# Altium schematic sheet thermocouple_1.SchDoc
size B; Address1: MILWAUKEE TOOL; Address2: 13135 W. Lisbon Rd.; Address3: Brookfield, WI 53005; SheetNumber: 1; SheetTotal: 1
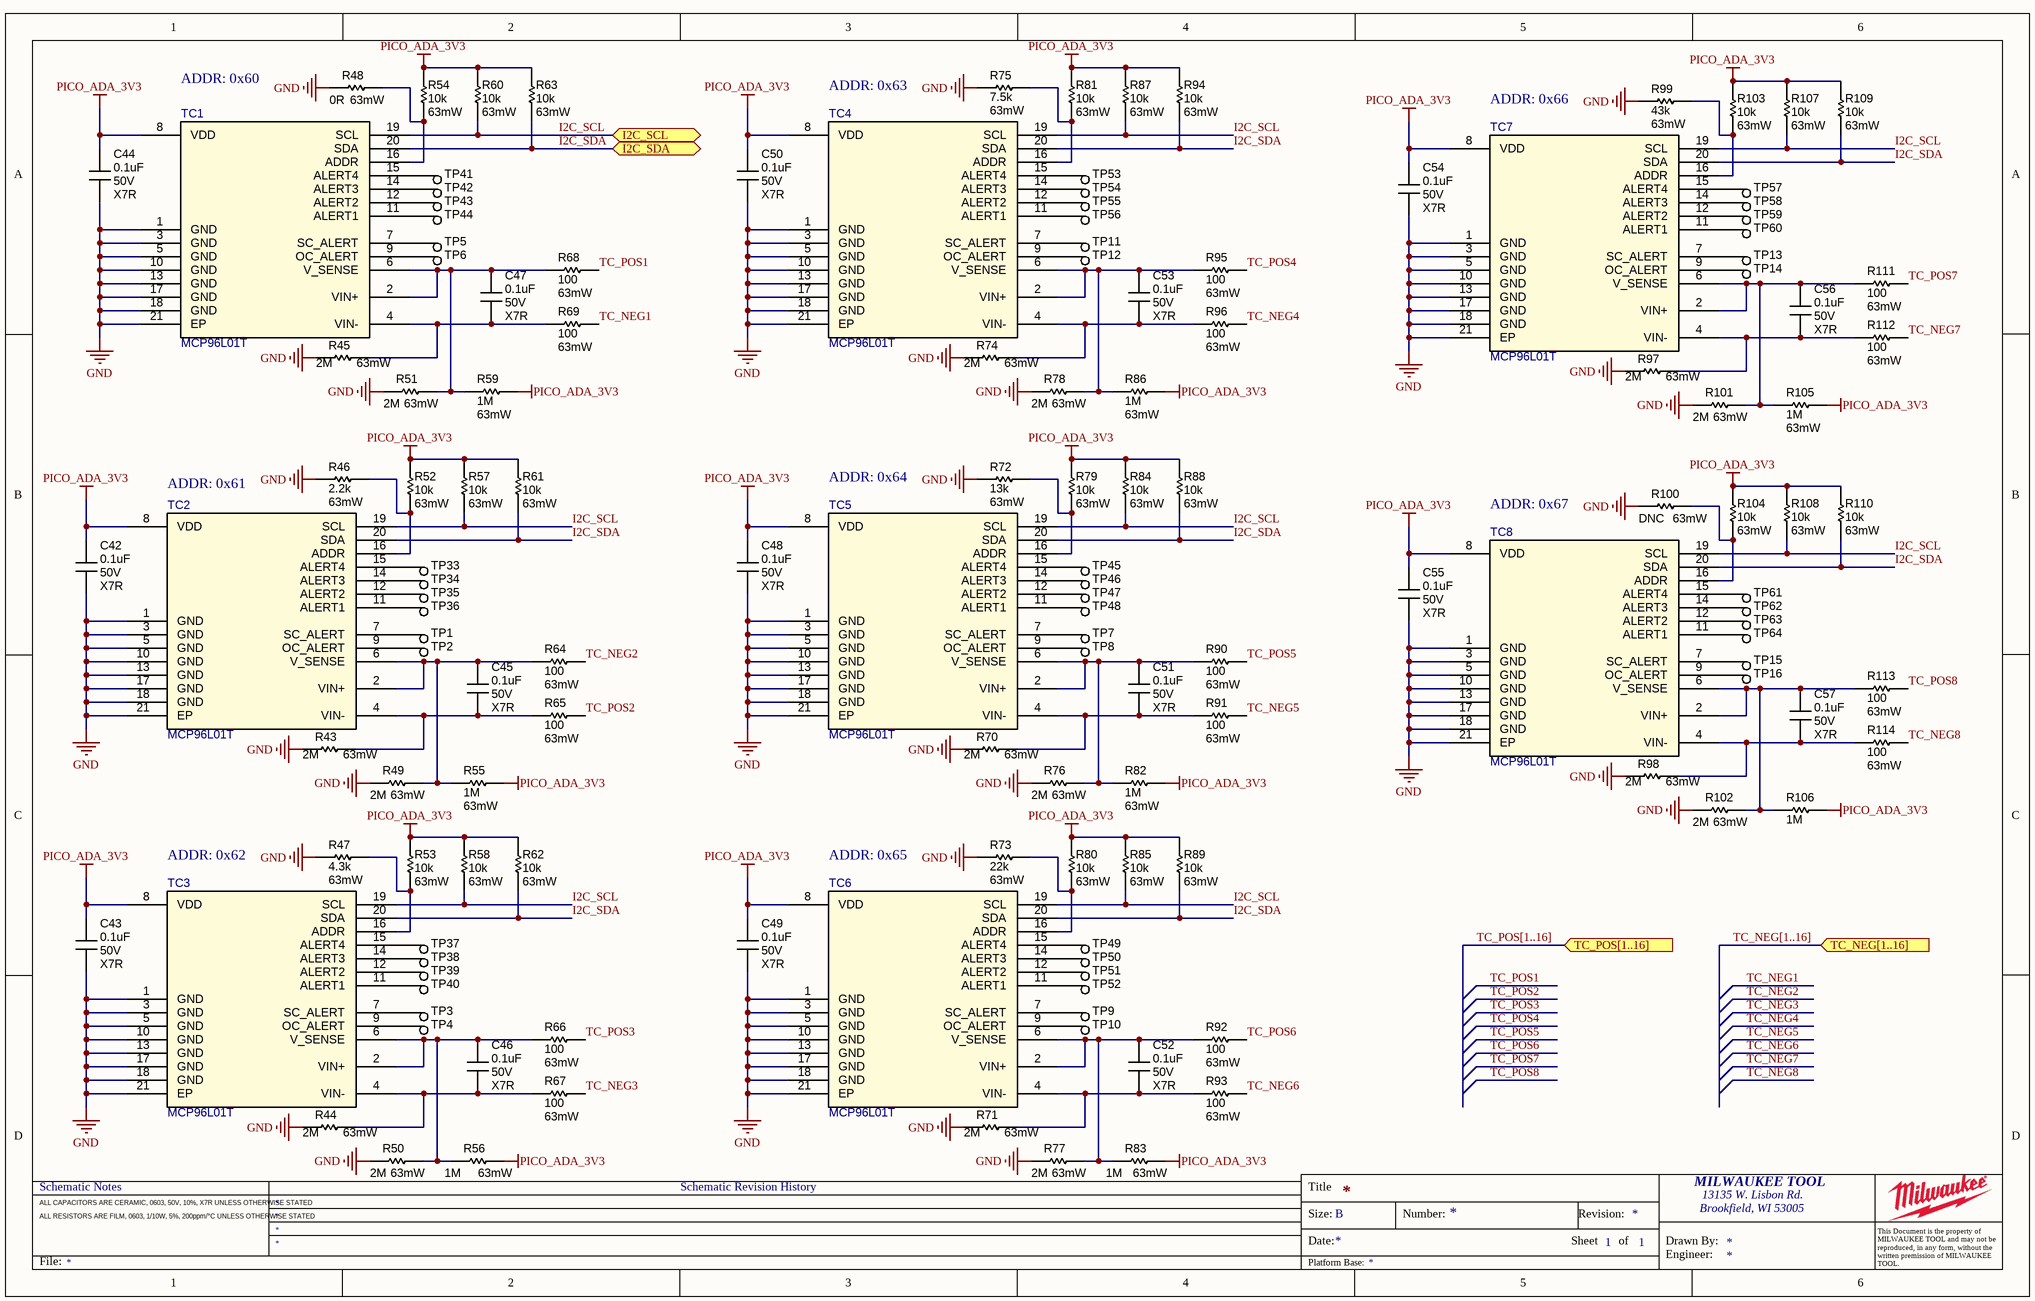
[diagram p0: thermocouple_1.SchDoc]

## Parts
C42  0.1uF  Voltage Rating: 50V  Temp Coeff: X7R  [CAPC1608X09N]
C43  0.1uF  Voltage Rating: 50V  Temp Coeff: X7R  [CAPC1608X09N]
C44  0.1uF  Voltage Rating: 50V  Temp Coeff: X7R  [CAPC1608X09N]
C45  0.1uF  Voltage Rating: 50V  Temp Coeff: X7R  [CAPC1005X06N]
C46  0.1uF  Voltage Rating: 50V  Temp Coeff: X7R  [CAPC1005X06N]
C47  0.1uF  Voltage Rating: 50V  Temp Coeff: X7R  [CAPC1005X06N]
C48  0.1uF  Voltage Rating: 50V  Temp Coeff: X7R  [CAPC1608X09N]
C49  0.1uF  Voltage Rating: 50V  Temp Coeff: X7R  [CAPC1608X09N]
C50  0.1uF  Voltage Rating: 50V  Temp Coeff: X7R  [CAPC1608X09N]
C51  0.1uF  Voltage Rating: 50V  Temp Coeff: X7R  [CAPC1005X06N]
C52  0.1uF  Voltage Rating: 50V  Temp Coeff: X7R  [CAPC1005X06N]
C53  0.1uF  Voltage Rating: 50V  Temp Coeff: X7R  [CAPC1005X06N]
C54  0.1uF  Voltage Rating: 50V  Temp Coeff: X7R  [CAPC1608X09N]
C55  0.1uF  Voltage Rating: 50V  Temp Coeff: X7R  [CAPC1608X09N]
C56  0.1uF  Voltage Rating: 50V  Temp Coeff: X7R  [CAPC1005X06N]
C57  0.1uF  Voltage Rating: 50V  Temp Coeff: X7R  [CAPC1005X06N]
R43  2M  Wattage: 63mW  [RESC1005X04N]
R44  2M  Wattage: 63mW  [RESC1005X04N]
R45  2M  Wattage: 63mW  [RESC1005X04N]
R46  2.2k  Wattage: 63mW  [RESC1005X04N]
R47  4.3k  Wattage: 63mW  [RESC1005X04N]
R48  0R  Wattage: 63mW  [RESC1005X04N]
R49  2M  Wattage: 63mW  [RESC1005X04N]
R50  2M  Wattage: 63mW  [RESC1005X04N]
R51  2M  Wattage: 63mW  [RESC1005X04N]
R52  10k  Wattage: 63mW  [RESC1005X04N]
R53  10k  Wattage: 63mW  [RESC1005X04N]
R54  10k  Wattage: 63mW  [RESC1005X04N]
R55  1M  Wattage: 63mW  [RESC1005X04N]
R56  1M  Wattage: 63mW  [RESC1005X04N]
R57  10k  Wattage: 63mW  [RESC1005X04N]
R58  10k  Wattage: 63mW  [RESC1005X04N]
R59  1M  Wattage: 63mW  [RESC1005X04N]
R60  10k  Wattage: 63mW  [RESC1005X04N]
R61  10k  Wattage: 63mW  [RESC1005X04N]
R62  10k  Wattage: 63mW  [RESC1005X04N]
R63  10k  Wattage: 63mW  [RESC1005X04N]
R64  100  Wattage: 63mW  [RESC1005X04N]
R65  100  Wattage: 63mW  [RESC1005X04N]
R66  100  Wattage: 63mW  [RESC1005X04N]
R67  100  Wattage: 63mW  [RESC1005X04N]
R68  100  Wattage: 63mW  [RESC1005X04N]
R69  100  Wattage: 63mW  [RESC1005X04N]
R70  2M  Wattage: 63mW  [RESC1005X04N]
R71  2M  Wattage: 63mW  [RESC1005X04N]
R72  13k  Wattage: 63mW  [RESC1005X04N]
R73  22k  Wattage: 63mW  [RESC1005X04N]
R74  2M  Wattage: 63mW  [RESC1005X04N]
R75  7.5k  Wattage: 63mW  [RESC1005X04N]
R76  2M  Wattage: 63mW  [RESC1005X04N]
R77  2M  Wattage: 63mW  [RESC1005X04N]
R78  2M  Wattage: 63mW  [RESC1005X04N]
R79  10k  Wattage: 63mW  [RESC1005X04N]
R80  10k  Wattage: 63mW  [RESC1005X04N]
R81  10k  Wattage: 63mW  [RESC1005X04N]
R82  1M  Wattage: 63mW  [RESC1005X04N]
R83  1M  Wattage: 63mW  [RESC1005X04N]
R84  10k  Wattage: 63mW  [RESC1005X04N]
R85  10k  Wattage: 63mW  [RESC1005X04N]
R86  1M  Wattage: 63mW  [RESC1005X04N]
R87  10k  Wattage: 63mW  [RESC1005X04N]
R88  10k  Wattage: 63mW  [RESC1005X04N]
R89  10k  Wattage: 63mW  [RESC1005X04N]
R90  100  Wattage: 63mW  [RESC1005X04N]
R91  100  Wattage: 63mW  [RESC1005X04N]
R92  100  Wattage: 63mW  [RESC1005X04N]
R93  100  Wattage: 63mW  [RESC1005X04N]
R94  10k  Wattage: 63mW  [RESC1005X04N]
R95  100  Wattage: 63mW  [RESC1005X04N]
R96  100  Wattage: 63mW  [RESC1005X04N]
R97  2M  Wattage: 63mW  [RESC1005X04N]
R98  2M  Wattage: 63mW  [RESC1005X04N]
R99  43k  Wattage: 63mW  [RESC1005X04N]
R100  DNC  Wattage: 63mW  [RESC1005X04N]
R101  2M  Wattage: 63mW  [RESC1005X04N]
R102  2M  Wattage: 63mW  [RESC1005X04N]
R103  10k  Wattage: 63mW  [RESC1005X04N]
R104  10k  Wattage: 63mW  [RESC1005X04N]
R105  1M  Wattage: 63mW  [RESC1005X04N]
R106  1M  [RESC1005X04N]
R107  10k  Wattage: 63mW  [RESC1005X04N]
R108  10k  Wattage: 63mW  [RESC1005X04N]
R109  10k  Wattage: 63mW  [RESC1005X04N]
R110  10k  Wattage: 63mW  [RESC1005X04N]
R111  100  Wattage: 63mW  [RESC1005X04N]
R112  100  Wattage: 63mW  [RESC1005X04N]
R113  100  Wattage: 63mW  [RESC1005X04N]
R114  100  Wattage: 63mW  [RESC1005X04N]
TC1  MCP96L01T  [QFN65P500X500X100_HS-21N]
TC2  MCP96L01T  [QFN65P500X500X100_HS-21N]
TC3  MCP96L01T  [QFN65P500X500X100_HS-21N]
TC4  MCP96L01T  [QFN65P500X500X100_HS-21N]
TC5  MCP96L01T  [QFN65P500X500X100_HS-21N]
TC6  MCP96L01T  [QFN65P500X500X100_HS-21N]
TC7  MCP96L01T  [QFN65P500X500X100_HS-21N]
TC8  MCP96L01T  [QFN65P500X500X100_HS-21N]
TP1  TP_SMT_1MM_CIR  [TP_SMT_1.0MM_CIR]  (value not drawn)  (no BOM)
TP2  TP_SMT_1MM_CIR  [TP_SMT_1.0MM_CIR]  (value not drawn)  (no BOM)
TP3  TP_SMT_1MM_CIR  [TP_SMT_1.0MM_CIR]  (value not drawn)  (no BOM)
TP4  TP_SMT_1MM_CIR  [TP_SMT_1.0MM_CIR]  (value not drawn)  (no BOM)
TP5  TP_SMT_1MM_CIR  [TP_SMT_1.0MM_CIR]  (value not drawn)  (no BOM)
TP6  TP_SMT_1MM_CIR  [TP_SMT_1.0MM_CIR]  (value not drawn)  (no BOM)
TP7  TP_SMT_1MM_CIR  [TP_SMT_1.0MM_CIR]  (value not drawn)  (no BOM)
TP8  TP_SMT_1MM_CIR  [TP_SMT_1.0MM_CIR]  (value not drawn)  (no BOM)
TP9  TP_SMT_1MM_CIR  [TP_SMT_1.0MM_CIR]  (value not drawn)  (no BOM)
TP10  TP_SMT_1MM_CIR  [TP_SMT_1.0MM_CIR]  (value not drawn)  (no BOM)
TP11  TP_SMT_1MM_CIR  [TP_SMT_1.0MM_CIR]  (value not drawn)  (no BOM)
TP12  TP_SMT_1MM_CIR  [TP_SMT_1.0MM_CIR]  (value not drawn)  (no BOM)
TP13  TP_SMT_1MM_CIR  [TP_SMT_1.0MM_CIR]  (value not drawn)  (no BOM)
TP14  TP_SMT_1MM_CIR  [TP_SMT_1.0MM_CIR]  (value not drawn)  (no BOM)
TP15  TP_SMT_1MM_CIR  [TP_SMT_1.0MM_CIR]  (value not drawn)  (no BOM)
TP16  TP_SMT_1MM_CIR  [TP_SMT_1.0MM_CIR]  (value not drawn)  (no BOM)
TP33  TP_SMT_1MM_CIR  [TP_SMT_1.0MM_CIR]  (value not drawn)  (no BOM)
TP34  TP_SMT_1MM_CIR  [TP_SMT_1.0MM_CIR]  (value not drawn)  (no BOM)
TP35  TP_SMT_1MM_CIR  [TP_SMT_1.0MM_CIR]  (value not drawn)  (no BOM)
TP36  TP_SMT_1MM_CIR  [TP_SMT_1.0MM_CIR]  (value not drawn)  (no BOM)
TP37  TP_SMT_1MM_CIR  [TP_SMT_1.0MM_CIR]  (value not drawn)  (no BOM)
TP38  TP_SMT_1MM_CIR  [TP_SMT_1.0MM_CIR]  (value not drawn)  (no BOM)
TP39  TP_SMT_1MM_CIR  [TP_SMT_1.0MM_CIR]  (value not drawn)  (no BOM)
TP40  TP_SMT_1MM_CIR  [TP_SMT_1.0MM_CIR]  (value not drawn)  (no BOM)
TP41  TP_SMT_1MM_CIR  [TP_SMT_1.0MM_CIR]  (value not drawn)  (no BOM)
TP42  TP_SMT_1MM_CIR  [TP_SMT_1.0MM_CIR]  (value not drawn)  (no BOM)
TP43  TP_SMT_1MM_CIR  [TP_SMT_1.0MM_CIR]  (value not drawn)  (no BOM)
TP44  TP_SMT_1MM_CIR  [TP_SMT_1.0MM_CIR]  (value not drawn)  (no BOM)
TP45  TP_SMT_1MM_CIR  [TP_SMT_1.0MM_CIR]  (value not drawn)  (no BOM)
TP46  TP_SMT_1MM_CIR  [TP_SMT_1.0MM_CIR]  (value not drawn)  (no BOM)
TP47  TP_SMT_1MM_CIR  [TP_SMT_1.0MM_CIR]  (value not drawn)  (no BOM)
TP48  TP_SMT_1MM_CIR  [TP_SMT_1.0MM_CIR]  (value not drawn)  (no BOM)
TP49  TP_SMT_1MM_CIR  [TP_SMT_1.0MM_CIR]  (value not drawn)  (no BOM)
TP50  TP_SMT_1MM_CIR  [TP_SMT_1.0MM_CIR]  (value not drawn)  (no BOM)
TP51  TP_SMT_1MM_CIR  [TP_SMT_1.0MM_CIR]  (value not drawn)  (no BOM)
TP52  TP_SMT_1MM_CIR  [TP_SMT_1.0MM_CIR]  (value not drawn)  (no BOM)
TP53  TP_SMT_1MM_CIR  [TP_SMT_1.0MM_CIR]  (value not drawn)  (no BOM)
TP54  TP_SMT_1MM_CIR  [TP_SMT_1.0MM_CIR]  (value not drawn)  (no BOM)
TP55  TP_SMT_1MM_CIR  [TP_SMT_1.0MM_CIR]  (value not drawn)  (no BOM)
TP56  TP_SMT_1MM_CIR  [TP_SMT_1.0MM_CIR]  (value not drawn)  (no BOM)
TP57  TP_SMT_1MM_CIR  [TP_SMT_1.0MM_CIR]  (value not drawn)  (no BOM)
TP58  TP_SMT_1MM_CIR  [TP_SMT_1.0MM_CIR]  (value not drawn)  (no BOM)
TP59  TP_SMT_1MM_CIR  [TP_SMT_1.0MM_CIR]  (value not drawn)  (no BOM)
TP60  TP_SMT_1MM_CIR  [TP_SMT_1.0MM_CIR]  (value not drawn)  (no BOM)
TP61  TP_SMT_1MM_CIR  [TP_SMT_1.0MM_CIR]  (value not drawn)  (no BOM)
TP62  TP_SMT_1MM_CIR  [TP_SMT_1.0MM_CIR]  (value not drawn)  (no BOM)
TP63  TP_SMT_1MM_CIR  [TP_SMT_1.0MM_CIR]  (value not drawn)  (no BOM)
TP64  TP_SMT_1MM_CIR  [TP_SMT_1.0MM_CIR]  (value not drawn)  (no BOM)

## Ports
I2C_SCL (bidir), I2C_SDA (bidir), TC_NEG[1..16] (in), TC_POS[1..16] (in)

## Nets
GND: C42.2 C43.2 C44.2 C48.2 C49.2 C50.2 C54.2 C55.2 R43.1 R44.1 R45.1 R46.1 R47.1 R48.1 R49.1 R50.1 R51.1 R70.1 R71.1 R72.1 R73.1 R74.1 R75.1 R76.1 R77.1 R78.1 R97.1 R98.1 R99.1 R100.1 R101.1 R102.1 TC1.1(GND) TC1.3(GND) TC1.5(GND) TC1.10(GND) TC1.13(GND) TC1.17(GND) TC1.18(GND) TC1.21(EP) TC2.1(GND) TC2.3(GND) TC2.5(GND) TC2.10(GND) TC2.13(GND) TC2.17(GND) TC2.18(GND) TC2.21(EP) TC3.1(GND) TC3.3(GND) TC3.5(GND) TC3.10(GND) TC3.13(GND) TC3.17(GND) TC3.18(GND) TC3.21(EP) TC4.1(GND) TC4.3(GND) TC4.5(GND) TC4.10(GND) TC4.13(GND) TC4.17(GND) TC4.18(GND) TC4.21(EP) TC5.1(GND) TC5.3(GND) TC5.5(GND) TC5.10(GND) TC5.13(GND) TC5.17(GND) TC5.18(GND) TC5.21(EP) TC6.1(GND) TC6.3(GND) TC6.5(GND) TC6.10(GND) TC6.13(GND) TC6.17(GND) TC6.18(GND) TC6.21(EP) TC7.1(GND) TC7.3(GND) TC7.5(GND) TC7.10(GND) TC7.13(GND) TC7.17(GND) TC7.18(GND) TC7.21(EP) TC8.1(GND) TC8.3(GND) TC8.5(GND) TC8.10(GND) TC8.13(GND) TC8.17(GND) TC8.18(GND) TC8.21(EP)
PICO_ADA_3V3: C42.1 C43.1 C44.1 C48.1 C49.1 C50.1 C54.1 C55.1 R52.2 R53.2 R54.2 R55.2 R56.2 R57.2 R58.2 R59.2 R60.2 R61.2 R62.2 R63.2 R79.2 R80.2 R81.2 R82.2 R83.2 R84.2 R85.2 R86.2 R87.2 R88.2 R89.2 R94.2 R103.2 R104.2 R105.2 R106.2 R107.2 R108.2 R109.2 R110.2 TC1.8(VDD) TC2.8(VDD) TC3.8(VDD) TC4.8(VDD) TC5.8(VDD) TC6.8(VDD) TC7.8(VDD) TC8.8(VDD)
I2C_SCL: R57.1 R58.1 R60.1 R84.1 R85.1 R87.1 R107.1 R108.1 TC1.19(SCL) TC2.19(SCL) TC3.19(SCL) TC4.19(SCL) TC5.19(SCL) TC6.19(SCL) TC7.19(SCL) TC8.19(SCL) ; port I2C_SCL
I2C_SDA: R61.1 R62.1 R63.1 R88.1 R89.1 R94.1 R109.1 R110.1 TC1.20(SDA) TC2.20(SDA) TC3.20(SDA) TC4.20(SDA) TC5.20(SDA) TC6.20(SDA) TC7.20(SDA) TC8.20(SDA) ; port I2C_SDA
TC_NEG1: R69.2
TC_NEG2: R64.2
TC_NEG3: R67.2
TC_NEG4: R96.2
TC_NEG5: R91.2
TC_NEG6: R93.2
TC_NEG7: R112.2
TC_NEG8: R114.2
TC_POS1: R68.2
TC_POS2: R65.2
TC_POS3: R66.2
TC_POS4: R95.2
TC_POS5: R90.2
TC_POS6: R92.2
TC_POS7: R111.2
TC_POS8: R113.2
NetC45_1: C45.1 R49.2 R55.1 R64.1 TC2.2(VIN+) TC2.6(V_SENSE)
NetC45_2: C45.2 R43.2 R65.1 TC2.4(VIN-)
NetC46_1: C46.1 R50.2 R56.1 R66.1 TC3.2(VIN+) TC3.6(V_SENSE)
NetC46_2: C46.2 R44.2 R67.1 TC3.4(VIN-)
NetC47_1: C47.1 R51.2 R59.1 R68.1 TC1.2(VIN+) TC1.6(V_SENSE)
NetC47_2: C47.2 R45.2 R69.1 TC1.4(VIN-)
NetC51_1: C51.1 R76.2 R82.1 R90.1 TC5.2(VIN+) TC5.6(V_SENSE)
NetC51_2: C51.2 R70.2 R91.1 TC5.4(VIN-)
NetC52_1: C52.1 R77.2 R83.1 R92.1 TC6.2(VIN+) TC6.6(V_SENSE)
NetC52_2: C52.2 R71.2 R93.1 TC6.4(VIN-)
NetC53_1: C53.1 R78.2 R86.1 R95.1 TC4.2(VIN+) TC4.6(V_SENSE)
NetC53_2: C53.2 R74.2 R96.1 TC4.4(VIN-)
NetC56_1: C56.1 R101.2 R105.1 R111.1 TC7.2(VIN+) TC7.6(V_SENSE)
NetC56_2: C56.2 R97.2 R112.1 TC7.4(VIN-)
NetC57_1: C57.1 R102.2 R106.1 R113.1 TC8.2(VIN+) TC8.6(V_SENSE)
NetC57_2: C57.2 R98.2 R114.1 TC8.4(VIN-)
NetR46_2: R46.2 R52.1 TC2.16(ADDR)
NetR47_2: R47.2 R53.1 TC3.16(ADDR)
NetR48_2: R48.2 R54.1 TC1.16(ADDR)
NetR72_2: R72.2 R79.1 TC5.16(ADDR)
NetR73_2: R73.2 R80.1 TC6.16(ADDR)
NetR75_2: R75.2 R81.1 TC4.16(ADDR)
NetR99_2: R99.2 R103.1 TC7.16(ADDR)
NetR100_2: R100.2 R104.1 TC8.16(ADDR)
NetTC1_7: TC1.7(SC_ALERT) TP5.1
NetTC1_9: TC1.9(OC_ALERT) TP6.1
NetTC1_11: TC1.11(ALERT1) TP44.1
NetTC1_12: TC1.12(ALERT2) TP43.1
NetTC1_14: TC1.14(ALERT3) TP42.1
NetTC1_15: TC1.15(ALERT4) TP41.1
NetTC2_7: TC2.7(SC_ALERT) TP1.1
NetTC2_9: TC2.9(OC_ALERT) TP2.1
NetTC2_11: TC2.11(ALERT1) TP36.1
NetTC2_12: TC2.12(ALERT2) TP35.1
NetTC2_14: TC2.14(ALERT3) TP34.1
NetTC2_15: TC2.15(ALERT4) TP33.1
NetTC3_7: TC3.7(SC_ALERT) TP3.1
NetTC3_9: TC3.9(OC_ALERT) TP4.1
NetTC3_11: TC3.11(ALERT1) TP40.1
NetTC3_12: TC3.12(ALERT2) TP39.1
NetTC3_14: TC3.14(ALERT3) TP38.1
NetTC3_15: TC3.15(ALERT4) TP37.1
NetTC4_7: TC4.7(SC_ALERT) TP11.1
NetTC4_9: TC4.9(OC_ALERT) TP12.1
NetTC4_11: TC4.11(ALERT1) TP56.1
NetTC4_12: TC4.12(ALERT2) TP55.1
NetTC4_14: TC4.14(ALERT3) TP54.1
NetTC4_15: TC4.15(ALERT4) TP53.1
NetTC5_7: TC5.7(SC_ALERT) TP7.1
NetTC5_9: TC5.9(OC_ALERT) TP8.1
NetTC5_11: TC5.11(ALERT1) TP48.1
NetTC5_12: TC5.12(ALERT2) TP47.1
NetTC5_14: TC5.14(ALERT3) TP46.1
NetTC5_15: TC5.15(ALERT4) TP45.1
NetTC6_7: TC6.7(SC_ALERT) TP9.1
NetTC6_9: TC6.9(OC_ALERT) TP10.1
NetTC6_11: TC6.11(ALERT1) TP52.1
NetTC6_12: TC6.12(ALERT2) TP51.1
NetTC6_14: TC6.14(ALERT3) TP50.1
NetTC6_15: TC6.15(ALERT4) TP49.1
NetTC7_7: TC7.7(SC_ALERT) TP13.1
NetTC7_9: TC7.9(OC_ALERT) TP14.1
NetTC7_11: TC7.11(ALERT1) TP60.1
NetTC7_12: TC7.12(ALERT2) TP59.1
NetTC7_14: TC7.14(ALERT3) TP58.1
NetTC7_15: TC7.15(ALERT4) TP57.1
NetTC8_7: TC8.7(SC_ALERT) TP15.1
NetTC8_9: TC8.9(OC_ALERT) TP16.1
NetTC8_11: TC8.11(ALERT1) TP64.1
NetTC8_12: TC8.12(ALERT2) TP63.1
NetTC8_14: TC8.14(ALERT3) TP62.1
NetTC8_15: TC8.15(ALERT4) TP61.1

## Buses and harness runs
bus TC_NEG[1..16] = port TC_NEG[1..16]
bus TC_POS[1..16] = port TC_POS[1..16]

## Notes on the sheet
- (near TC1) ADDR: 0x60
- (near TC4) ADDR: 0x63
- (near TC7) ADDR: 0x66
- (near TC2) ADDR: 0x61
- (near TC5) ADDR: 0x64
- (near TC8) ADDR: 0x67
- (near TC3) ADDR: 0x62
- (near TC6) ADDR: 0x65
- Schematic Notes
- Schematic Revision History
- Title
- ALL CAPACITORS ARE CERAMIC, 0603, 50V, 10%, X7R UNLESS OTHERWISE STATED
- ALL RESISTORS ARE FILM, 0603, 1/10W, 5%, 200ppm/°C UNLESS OTHERWISE STATED
- Size:
- Date:
- B
- Number:
- Sheet
- Revision:
- of
- Drawn By:
- Brookfield, WI 53005
- File:
- Platform Base:
- Engineer:
- This Document is the property of MILWAUKEE TOOL and may not be reproduced, in any form, without the written premission of MILWAUKEE TOOL.

## Library data of the parts
C42-C44 C48-C50 C54 C55 = CMP-004-0070: CAP CER 0.1UF 50V X7R 0603; MFR#: C0603C104K5RACTU; MFR: KEMET; MFR2#: CC0603KRX7R9BB104; Tolerance: 10%; Temp Range: -55 / +125 C; Capacitor Type: Ceramic; Case Code (Imperial): 0608; Value: 0.1uF; Design Item ID: CN/0.1uF/50V/X7R/10%/0603; Case Code (Metric): 1608; ComponentLink1URL: https://product.tdk.com/info/en/catalog/datasheets/mlcc_automotive_midvoltage_en.pdf?ref_disty=digikey; MFR2: Yageo; ComponentLink1Description: Datasheet; Part Status: Production; Lead Free: *
C45-C47 C51-C53 C56 C57 = CMP-004-0076: CAP CER SMD 0.1UF 50V X7R 0402; MFR3#: KGM05CR71H104KH; MFR#: GRM155R71H104KE14D; MFR: Murata Electronics; MFR4#: CL05B104KB54PNC; MFR2#: C1005X7R1H104K050BB; Tolerance: 10%; Populate: Yes; Temp Range: -55 / +125 C; Capacitor Type: Ceramic; Case Code (Imperial): 0402; Value: 0.1uF; MFR4: Samsung Electro-Mechanics; Design Item ID: CN/0.1uF/50V/X7R/10%/0402; Case Code (Metric): 1005; ComponentLink1URL: https://search.murata.co.jp/Ceramy/image/img/A01X/G101/ENG/GRM155R71H104KE14-01.pdf; MFR3: KYOCERA AVX; MFR2: TDK Corporation; ComponentLink1Description: Datasheet; RoHS Compliant: Yes; Part Status: Production
R43-R45 R49-R51 R70 R71 R74 R76-R78 R97 R98 R101 R102 = CMP-025-0172: RES SMD 2M OHM 1% 1/16W 0402; MFR#: RC0402FR-072ML; MFR: YAGEO; Value: 2M Ohm; Temp Range: -55 / +155 C; Temperature Coefficient: 100ppm/°C; Populate: Yes; Tolerance: 1%; ComponentLink1Description: Datasheet; ComponentLink1URL: https://yageogroup.com/content/datasheet/asset/file/PYU-RC_GROUP_51_ROHS_L; Resistor Type: Thick Film; Case Code (Imperial): 0402; Case Code (Metric): 1005; Design Item ID: R/2.0M/0.063W/1%/0402; RoHS Compliant: Yes; Part Status: Production
R46 = CMP-025-0171: RES SMD 2.2K OHM 1% 1/16W 0402; MFR#: RC0402FR-072K2L; MFR: YAGEO; Voltage Rating: 250V; Temp Range: -55 / +155 C; Current: 6A; Temperature Coefficient: 100ppm/°C; Populate: Yes; Value: 2.2k Ohm; Tolerance: 1%; ComponentLink1Description: Datasheet; ComponentLink1URL: https://yageogroup.com/content/datasheet/asset/file/PYU-RC_GROUP_51_ROHS_L; Resistor Type: Thick Film; Case Code (Imperial): 0402; Case Code (Metric): 3216; Design Item ID: R/2.2K/0.063W/1%/0402; RoHS Compliant: Yes; Part Status: Production
R47 = CMP-025-0176: RES SMD 4.3K OHM 1% 1/16W 0402; MFR#: RC0402FR-074K3L; MFR: Yageo; Temp Range: -55 / +155 C; Temperature Coefficient: 50 ppm/°C; Populate: Yes; Value: 4.3k Ohm; Tolerance: 1%; ComponentLink1Description: Datasheet; ComponentLink1URL: https://yageogroup.com/content/datasheet/asset/file/PYU-RC_GROUP_51_ROHS_L; Resistor Type: Thick Film; Case Code (Imperial): 0402; Case Code (Metric): 1005; Design Item ID: R/4.3K/0.063W/1%/0402; RoHS Compliant: Yes; Part Status: Production
R48 R100 = CMP-025-0102: RES SMD 0 OHM JUMPER 1/16W 0402; MFR3#: CRCW04020000Z0ED; MFR: Stackpole Electronics Inc; MFR2#: AC0402JR-070RL; MFR4#: RS-02K000JT; MFR#: RMCF0402ZT0R00; Value: 0 ohm; Quality: AEC-Q200; Voltage Rating: 50V; Current: 1A; Temp Range: -55 / +155 C; Case Code (Metric): 1002; Case Code (Imperial): 0402; MFR2: YAGEO; Design Item ID: R/0.00/0.063W/JUMPER/0402; MFR4: FengHua; Resistor Type: Thick Film; ClassName: Fine_Pitch; MFR3: Vishay Dale; Tolerance: Jumper; REACH SVHC: Yes; RoHS Compliant: Yes
R52-R54 R57 R58 R60-R63 R79-R81 R84 R85 R87-R89 R94 R103 R104 R107-R110 = CMP-025-0026: RES SMD 10K OHM 0.5% 1/16W 0402; MFR2#: RNCF0402DTE10K0; MFR#: ERA-2AED103X; MFR: Panasonic Electronic Components; Temp Range: -55 / +155 C; Voltage Rating: 50V; Temperature Coefficient: 25ppm/°C; Quality: AEC-Q200; MFR2: Stackpole Electronics Inc; RoHS Compliant: Yes; ComponentLink1Description: Datasheet; REACH SVHC: Yes; Value: 10k; Case Code (Imperial): 0402; Case Code (Metric): 1005; Tolerance: 0.5%; Resistor Type: Thick Film; Design Item ID: R/10.0K/0.063W/0.5%/0402; ComponentLink1URL: https://industrial.panasonic.com/cdbs/www-data/pdf/RDM0000/AOA0000C307.pdf
R55 R56 R59 R82 R83 R86 R105 R106 = CMP-025-0173: RES SMD 1M OHM 1% 1/16W 0402; MFR#: RC0402FR-071ML; MFR: YAGEO; Value: 1M Ohm; Temp Range: -55 / +155 C; Temperature Coefficient: 100ppm/°C; Populate: Yes; Tolerance: 1%; ComponentLink1Description: Datasheet; ComponentLink1URL: https://yageogroup.com/content/datasheet/asset/file/PYU-RC_GROUP_51_ROHS_L; Resistor Type: Thick Film; Case Code (Imperial): 0402; Case Code (Metric): 1005; Design Item ID: R/1.0M/0.063W/1%/0402; RoHS Compliant: Yes; Part Status: Production
R64-R69 R90-R93 R95 R96 R111-R114 = CMP-025-0156: RES SMD 100 OHM 1% 1/16W 0402; MFR4#: CR0402-FX-1000GLF; MFR#: RMCF0402FT100R; MFR: Stackpole Electronics Inc; MFR3#: CRCW0402100RFKED; MFR2#: RC0402FR-07100RL; Value: 100 Ohm; Voltage Rating: 75V; Temp Range: -55 / +155 C; Current: 1A; Temperature Coefficient: 100ppm/°C; Populate: Yes; MFR2: YAGEO; Tolerance: 1%; MFR3: Vishay Dale; ComponentLink1Description: Datasheet; ComponentLink1URL: https://www.yageo.com/upload/media/product/products/datasheet/rchip/PYu-RC_Group_51_RoHS_L_12.pdf; Resistor Type: Thick Film; Case Code (Imperial): 0402; MFR4: Bourns Inc; Case Code (Metric): 1005; Design Item ID: R/100.0/0.063W/1%/0402; RoHS Compliant: Yes
R72 = CMP-025-0178: RES SMD 13K OHM 1% 1/16W 0402; MFR#: RC0402FR-0713KL; MFR: Yageo; Value: 13k Ohm; Temp Range: -55 / +155 C; Temperature Coefficient: 50 ppm/°C; Populate: Yes; Tolerance: 1%; ComponentLink1Description: Datasheet; ComponentLink1URL: https://yageogroup.com/content/datasheet/asset/file/PYU-RC_GROUP_51_ROHS_L; Resistor Type: Thick Film; Case Code (Imperial): 0402; Case Code (Metric): 1005; Design Item ID: R/13K/0.063W/1%/0402; RoHS Compliant: Yes; Part Status: Production
R73 = CMP-025-0179: RES SMD 22K OHM 1% 1/16W 0402; MFR#: RC0402FR-0722KL; MFR: Yageo; Value: 22k Ohm; Temp Range: -55 / +155 C; Temperature Coefficient: 50 ppm/°C; Populate: Yes; Tolerance: 1%; ComponentLink1Description: Datasheet; ComponentLink1URL: https://yageogroup.com/content/datasheet/asset/file/PYU-RC_GROUP_51_ROHS_L; Resistor Type: Thick Film; Case Code (Imperial): 0402; Case Code (Metric): 1005; Design Item ID: R/22K/0.063W/1%/0402; RoHS Compliant: Yes; Part Status: Production
R75 = CMP-025-0177: RES SMD 7.5K OHM 1% 1/16W 0402; MFR#: RC0402FR-077K5L; MFR: Yageo; Temp Range: -55 / +155 C; Temperature Coefficient: 50 ppm/°C; Populate: Yes; Value: 7.5k Ohm; Tolerance: 1%; ComponentLink1Description: Datasheet; ComponentLink1URL: https://yageogroup.com/content/datasheet/asset/file/PYU-RC_GROUP_51_ROHS_L; Resistor Type: Thick Film; Case Code (Imperial): 0402; Case Code (Metric): 1005; Design Item ID: R/7.5K/0.063W/1%/0402; RoHS Compliant: Yes; Part Status: Production
R99 = CMP-025-0180: RES SMD 43K OHM 1% 1/16W 0402; MFR#: RC0402FR-0743KL; MFR: Yageo; Value: 43k Ohm; Temp Range: -55 / +155 C; Temperature Coefficient: 50 ppm/°C; Populate: Yes; Tolerance: 1%; ComponentLink1Description: Datasheet; ComponentLink1URL: https://yageogroup.com/content/datasheet/asset/file/PYU-RC_GROUP_51_ROHS_L; Resistor Type: Thick Film; Case Code (Imperial): 0402; Case Code (Metric): 1005; Design Item ID: R/43K/0.063W/1%/0402; RoHS Compliant: Yes; Part Status: Production
TC1-TC8 = CMP-017-0115: IC THERMOCOUPLE AMPLIFIER I2C; MFR: Microchip; Value: MCP96L01T-E/MX; Populate: Yes; REACFH SVCH: Unaffected; Temp Range, Ambient: -40 / +125 C; Voltage Range: 2.3V / +5.5 V; Temp Range, Junction: -40 / +150C; MFR#: MCP96L01T-E/MX; Case Package: QFN-21N; Design Item ID: IC/TC/MCP96L01/QFN20; Part Status: Production; RoHS Comliant: Yes; Type: THERMOCOUPLE; ComponentLink1Description: Datasheet; ComponentLink1URL: https://ww1.microchip.com/downloads/en/DeviceDoc/MCP960X-L0X-RL0X-Data-Sheet-20005426F.pdf
TP1-TP16 TP33-TP64 = CMP-019-0006: TP SMT 1mm Circle; Value: TP_1mm; Populate: DNP; ClassName: Test Point; Design Item ID: TP_SMT_1MM_CIR; Shape/Size: 1mm Circle